# Altium schematic sheet Gate Driver 1.SchDoc
size A3
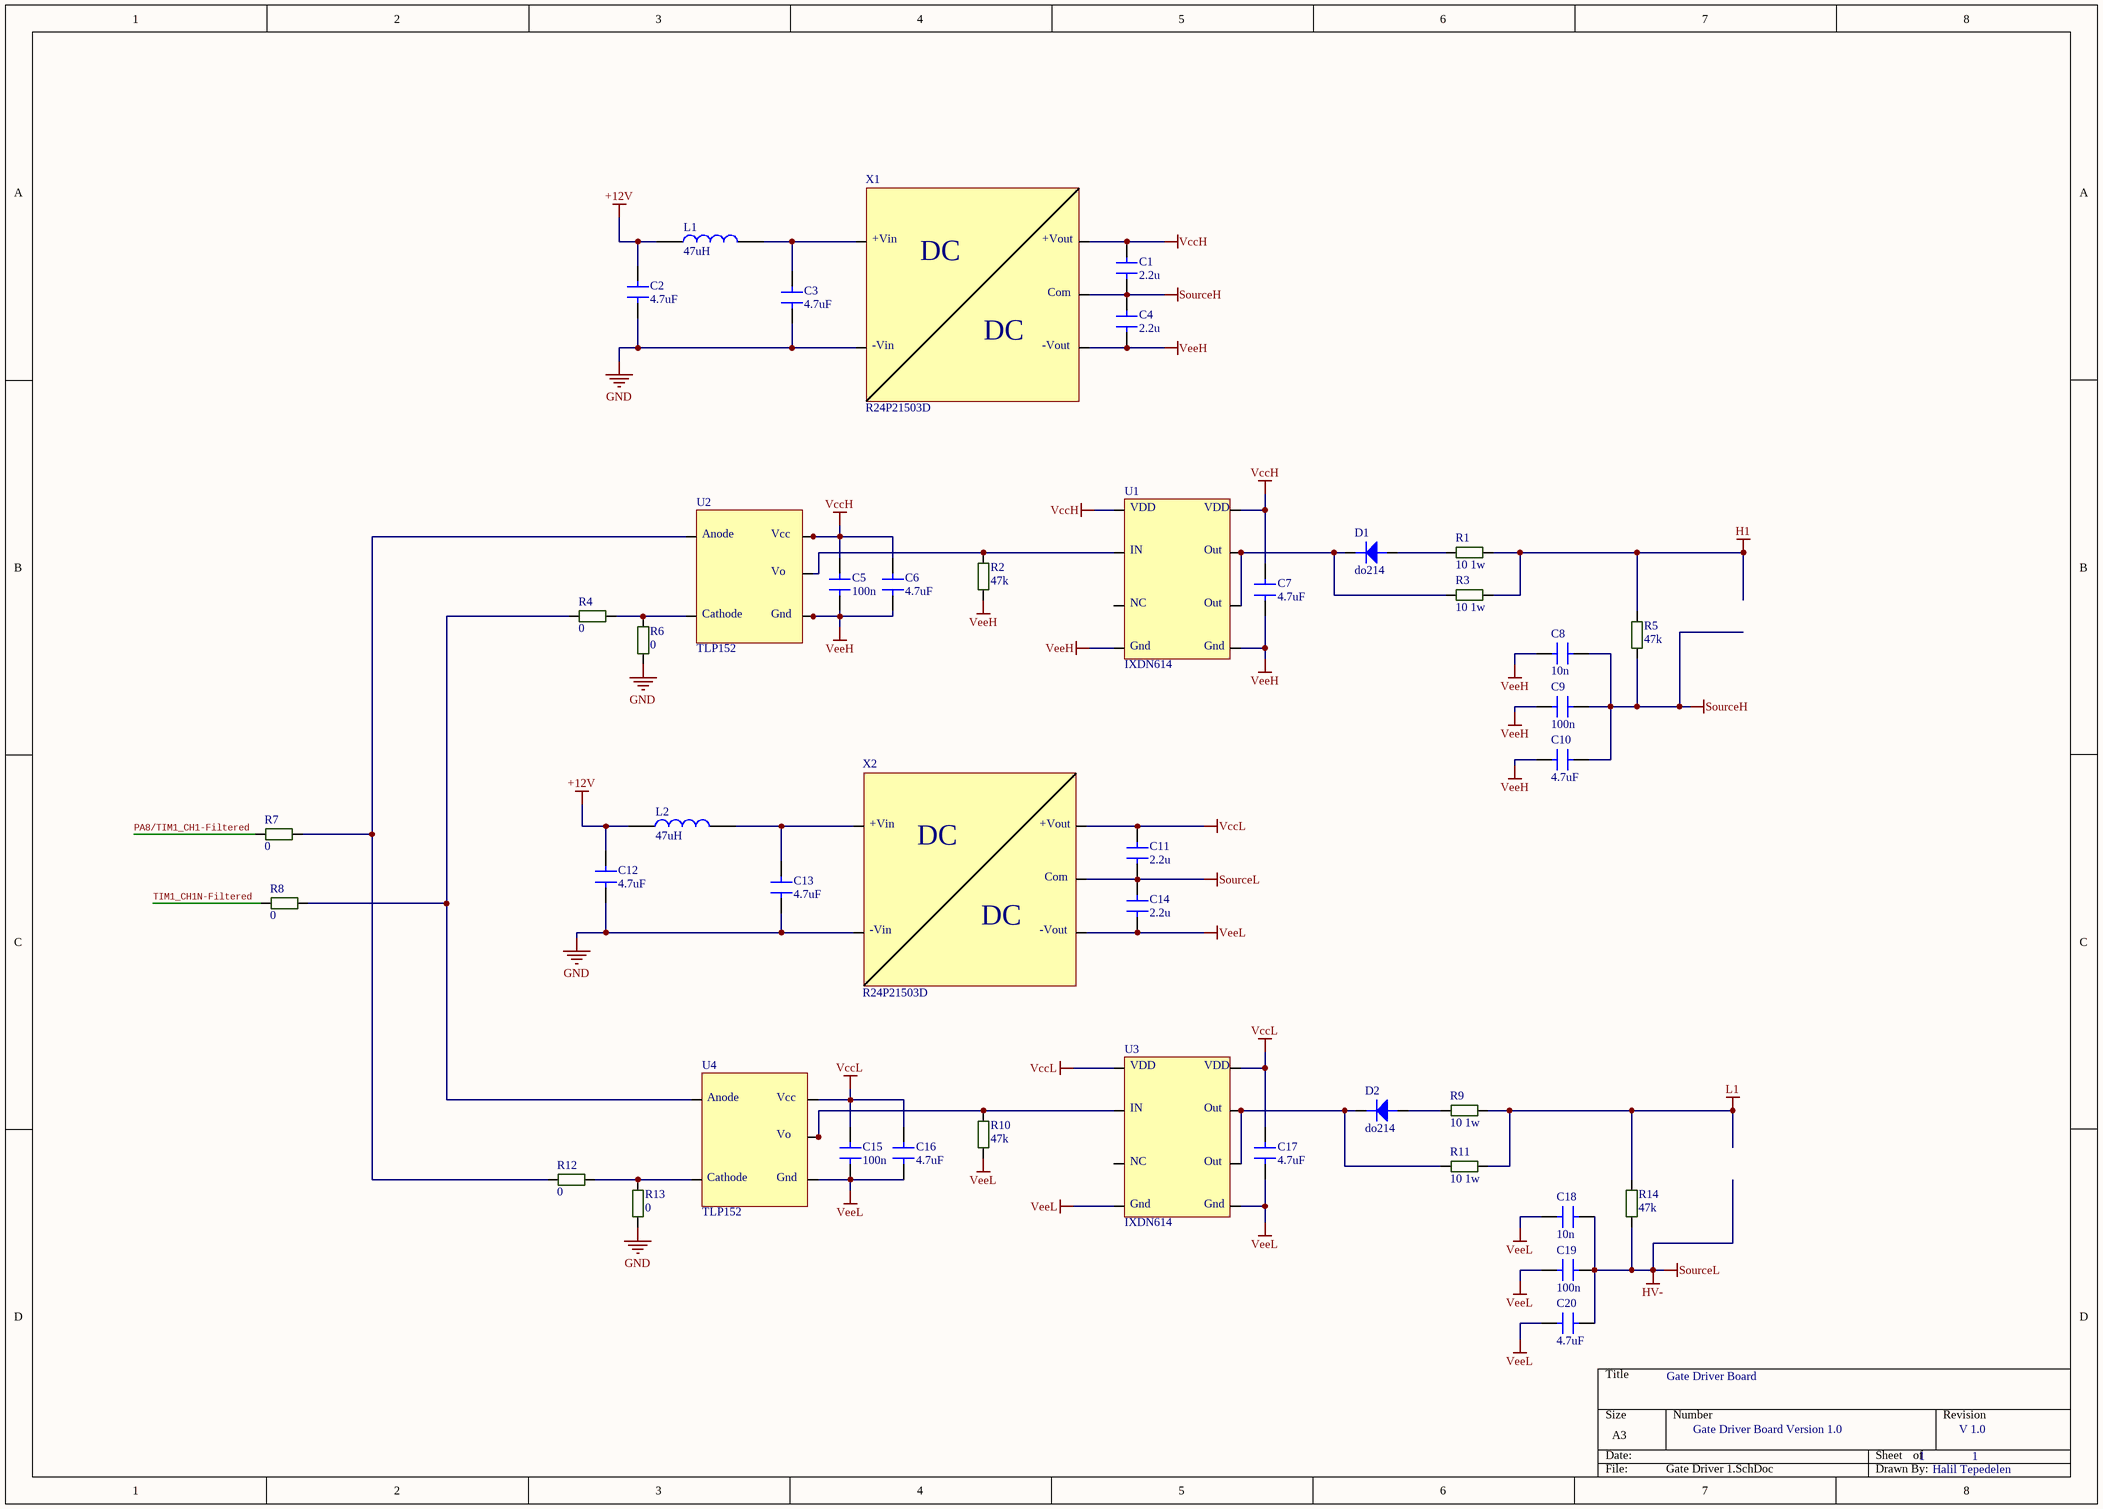
[diagram p0: Gate Driver 1.SchDoc]

## Parts
C1  2.2u  [C-0805]
C2  4.7uF  [C-1206]
C3  4.7uF  [C-1206]
C4  2.2u  [C-0805]
C5  100n  [C-0805]
C6  4.7uF  [C-1206]
C7  4.7uF  [C-1206]
C8  10n  [C-0805]
C9  100n  [C-0805]
C10  4.7uF  [C-1206]
C11  2.2u  [C-0805]
C12  4.7uF  [C-1206]
C13  4.7uF  [C-1206]
C14  2.2u  [C-0805]
C15  100n  [C-0805]
C16  4.7uF  [C-1206]
C17  4.7uF  [C-1206]
C18  10n  [C-0805]
C19  100n  [C-0805]
C20  4.7uF  [C-1206]
D1  do214  [DO-214AC]
D2  do214  [DO-214AC]
L1  47uH  [WE-TPC_282892]
L2  47uH  [WE-TPC_282892]
R1  10 1w  [R-2512]
R2  47k  [R-0805]
R3  10 1w  [R-2512]
R4  0  [R-0805]
R5  47k  [R-0805]
R6  0  [R-0805]
R7  0  [R-0805]
R8  0  [R-0805]
R9  10 1w  [R-2512]
R10  47k  [R-0805]
R11  10 1w  [R-2512]
R12  0  [R-0805]
R13  0  [R-0805]
R14  47k  [R-0805]
U1  IXDN614  [FAN3122 Soic8]
U2  TLP152  [TLP152]
U3  IXDN614  [FAN3122 Soic8]
U4  TLP152  [TLP152]
X1  R24P21503D  [SIP7]
X2  R24P21503D  [SIP7]

## Nets
+12V: C2.2 C12.2 L1.1 L2.1
GND: C2.1 C3.1 C12.1 C13.1 R6.1 R13.1 X1.2 X2.2
H1: R1.2 R3.2 R5.2
HV-: C11.1 C14.2 C18.1 C19.1 C20.2 R14.1 X2.6  [also labelled SourceL]
L1: R9.2 R11.2 R14.2
SourceH: C1.1 C4.2 C8.1 C9.1 C10.2 R5.1 X1.6
VccH: C1.2 C5.2 C6.2 C7.2 U1.1 U1.8 U2.5 X1.7
VccL: C11.2 C15.2 C16.2 C17.2 U3.1 U3.8 U4.5 X2.7
VeeH: C4.1 C5.1 C6.1 C7.1 C8.2 C9.2 C10.1 R2.1 U1.4 U1.5 U2.3 X1.5
VeeL: C14.1 C15.1 C16.1 C17.1 C18.2 C19.2 C20.1 R10.1 U3.4 U3.5 U4.3 X2.5
PA8/TIM1_CH1-Filtered: R7.1
TIM1_CH1N-Filtered: R8.1
NetC3_2: C3.2 L1.2 X1.1
NetC13_2: C13.2 L2.2 X2.1
NetD1_a: D1.a R1.1
NetD1_k: D1.k R3.1 U1.6 U1.7
NetD2_a: D2.a R9.1
NetD2_k: D2.k R11.1 U3.6 U3.7
NetR2_2: R2.2 U1.2 U2.4
NetR4_1: R4.1 R8.2 U4.1
NetR4_2: R4.2 R6.2 U2.2
NetR7_2: R7.2 R12.1 U2.1
NetR10_2: R10.2 U3.2 U4.4
NetR12_2: R12.2 R13.2 U4.2

Not connected (* = marked no-connect by the designer): U1 3; U3 3

## Notes on the sheet
- Gate Driver Board
- Gate Driver Board Version 1.0
- 1
- V 1.0
- Halil Tepedelen
- (in symbol IXDN614SITR) VDD; IN; Out; NC; Gnd
- (in symbol R24P21503D) +Vin; +Vout; DC; Com; -Vin; -Vout
- (in symbol TLP152(TPL,E) Anode; Vcc; Vo; Cathode; Gnd

## Library data of the parts
C1 C4 C5 C8 C9 C11 C14 C15 C18 C19 = C-0805
C2 C3 C10 C12 C13 C20 = Cap1206: Cap1206 4.7uF; Özdisan Part Number: CL31B475KBHNNNE; Manufacturer: SAMSUNG; Link: https://www.ozdisan.com/pasif-komponentler/kondansatorler/smd-kondansatorler-mlcc/CL31B475KBHNNNE; Price: 0,10407
C6 C7 C16 C17 = C-1206: Cap1206 4.7uF
D1 D2 = do214: DIODE FAST SWITCHING Single 150mA 75V SMT SOD323
L1 L2 = inductor
R1 R3 R9 R11 = R-2512: R-2512 10R 1W
R2 = Res0805: Res0805 47K R; Manufacturer: ROYALOHM; Özdisan Part Number: 0805S8J0473T5E; Link: https://www.ozdisan.com/pasif-komponentler/direncler/smt-smd-direncler/0805S8J0473T5E; Price: 0,00234
R4 R6-R8 R12 R13 = Res0805: Res0805 0R; Manufacturer: ROYALOHM; Özdisan Part Number: 0805S8J0000T5E; Price: 0,00234; Link: https://www.ozdisan.com/pasif-komponentler/direncler/smt-smd-direncler/0805S8J0000T5E
R5 R10 R14 = Res0805: Res0805 47K R; Özdisan Part Number: 0805S8J0473T5E; Manufacturer: ROYALOHM; Link: https://www.ozdisan.com/pasif-komponentler/direncler/smt-smd-direncler/0805S8J0473T5E; Price: 0,00234
U1 U3 = IXDN614SITR: 14A 8SOIC EXP MTL NON INVERTING; Manufacturer: Ixys Clare; Rise Time: 35ns; Propagation Delay: 70ns; Max Supply Voltage: 35V; Min Supply Voltage: 4.5V; Number of Outputs: 1; Fall Time: 25ns; ComponentLink1URL: https://datasheet.ciiva.com/6613/ixd-614-6613145.pdf?src-supplier=Digi-Key; ComponentLink1Description: https://datasheet.ciiva.com/6613/ixd-614-6613145.pdf?src-supplier=Digi-Key; Supplier 1: Mouser; Manufacturer Part Number: IXDN614SITR; RoHS: Yes; Pricing 1: 1 = 4.24000, 10 = 3.79000, 50 = 3.41000, 100 = 3.10000, 1000 = 2.12000, 10000 = 1.90000 (USD); Mount: Surface Mount; Case/Package: SOIC; Number of Pins: 8; Min Operating Temperature: -40°C; Max Operating Temperature: 125°C; Max Output Current: 14A; Packaging: Tape and Reel; Package Quantity: 2000; Number of Drivers: 1; Lead Free: Lead Free; Supplier Part Number 1: 849-IXDN614SITR
U2 U4 = TLP152(TPL,E: OPTOISO 3.75KV GATE DRIVER 6SO-5; Manufacturer: Toshiba; Number of Channels: 1; Propagation Delay: 165ns; Max Power Dissipation: 260mW; Direction: Unidirectional; Turn-On Delay Time: 190ns; Fall Time: 22ns; Forward Voltage: 1.57V; Output Current: 2.5A; Forward Current: 10mA; Rise Time: 18ns; High Level Output Current: 2A; Pulse Width Distortion (PWD): 50ns; ComponentLink1URL: https://datasheet.ciiva.com/41848/tlp152-datasheet-en-20120914-41848928.pdf?src-supplier=Digi-Key; ComponentLink1Description: https://datasheet.ciiva.com/41848/tlp152-datasheet-en-20120914-41848928.pdf?src-supplier=Digi-Key; Supplier 1: Mouser; Manufacturer Part Number: TLP152(TPL,E; RoHS: Yes; Stock 1: 22321; Pricing 1: 1 = 1.55000, 10 = 0.96800, 50 = 0.96800, 100 = 0.87200, 1000 = 0.54300, 10000 = 0.44000 (USD); Mount: Surface Mount; Case/Package: SO; Number of Pins: 5; Min Operating Temperature: -40°C; Max Operating Temperature: 100°C; Packaging: Tape and Reel; Package Quantity: 3000; Low Level Output Current: 2A; Max Output Current: 2.5A; Supplier Part Number 1: 757-TLP152TPLE
X1 X2 = R24P21503D: Manufacturer: Recom; Max Output Voltage: 15V; Supplier 1: Digi-Key; Manufacturer Part Number: R24P21503D; RoHS: No; Stock 1: 378; Pricing 1: 1 = 8.78000, 5 = 8.71200, 10 = 8.64500, 25 = 8.51200, 50 = 8.24600, 100 = 7.44800, 250 = 7.31500, 500 = 7.18200 (USD); Weight: 4.3g; Length: 19.5mm; Height: 12.5mm; Width: 9.8mm; Supplier Part Number 1: 945-3071-5-ND